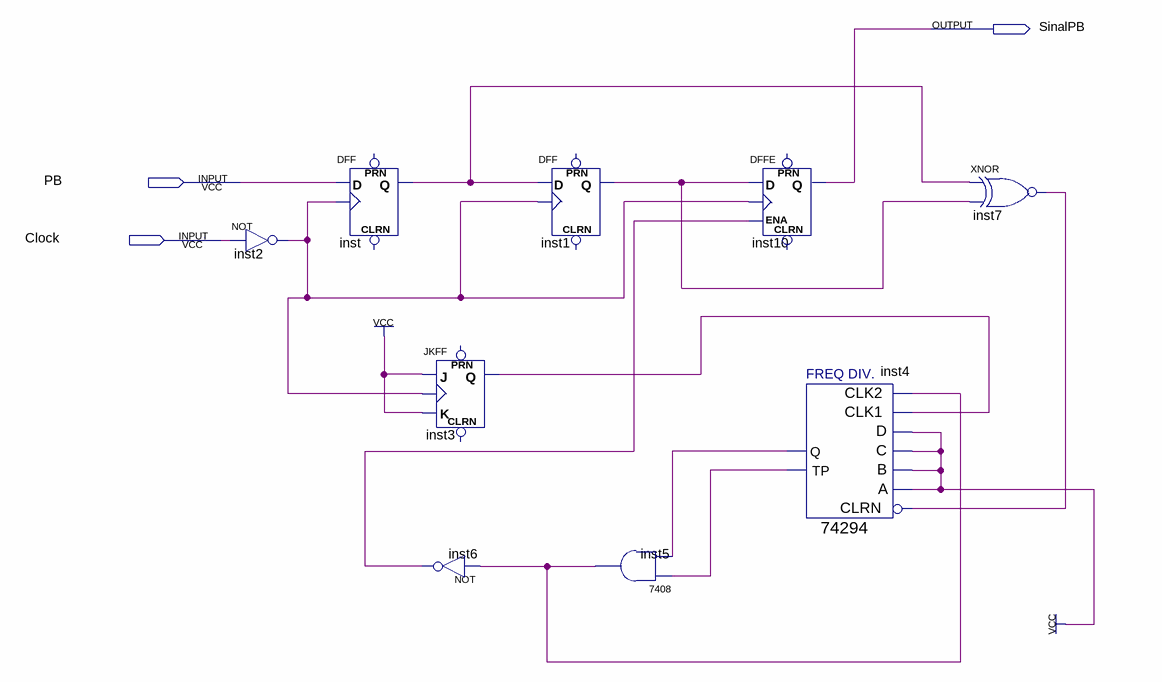
[diagram p0: schematic sheet]
// Quartus schematic Debounce.bdf as structural Verilog: 9 symbols, 3 pins
module Debounce (
  input  PB,
  input  Clock,
  output SinalPB
);

  wire inst1_q, inst2_out, inst3_q, inst4_q, inst4_tp, inst5_1, inst6_out, inst7_out, inst_q;

  not inst2 (inst2_out, Clock);
  DFF inst (.CLK(inst2_out), .D(PB), .Q(inst_q));  // open: CLRN, PRN
  JKFF inst3 (.K(1'b1), .J(1'b1), .CLK(inst2_out), .Q(inst3_q));  // open: PRN, CLRN
  not inst6 (inst6_out, inst5_1);
  DFF inst1 (.CLK(inst2_out), .D(inst_q), .Q(inst1_q));  // open: CLRN, PRN
  \7408  inst5 (.\3 (inst4_q), .\2 (inst4_tp), .\1 (inst5_1));
  DFFE inst10 (.D(inst1_q), .CLK(inst2_out), .ENA(inst6_out), .Q(SinalPB));  // open: PRN, CLRN
  \74294  inst4 (
    .A(1'b1), .B(1'b1), .C(1'b1), .CLK1(inst3_q), .CLK2(inst5_1), .CLRN(inst7_out), .D(1'b1), .Q(inst4_q),
    .TP(inst4_tp));
  xnor inst7 (inst7_out, inst_q, inst1_q);
endmodule
